# Altium schematic sheet HDMI.SchDoc
size A4; SheetNumber: 11; SheetTotal: 13
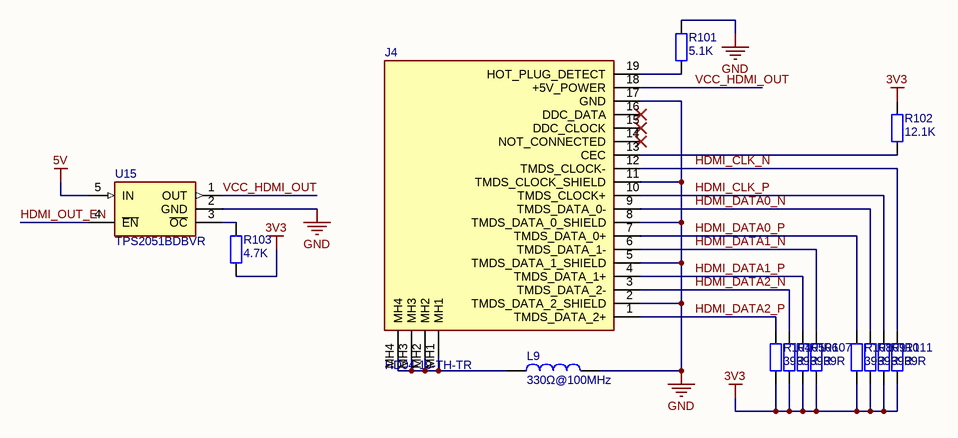
[diagram p0: HDMI.SchDoc]

## Parts
J4  HD04-19-TH-TR  [HD0419THTR]
L9  330Ω@100MHz  [L 0805]
R101  5.1K  [R 0402_L]
R102  12.1K  [R 0805_L]
R103  4.7K  [R 0402_L]
R104  39R  [R 0805_L]
R105  39R  [R 0805_L]
R106  39R  [R 0805_L]
R107  39R  [R 0805_L]
R108  39R  [R 0805_L]
R109  39R  [R 0805_L]
R110  39R  [R 0805_L]
R111  39R  [R 0805_L]
U15  TPS2051BDBVR  [SOT23-5N]

## Nets
3V3: R102.1 R103.1 R104.2 R105.2 R106.2 R107.2 R108.2 R109.2 R110.2 R111.2
5V: U15.5(IN)
GND: J4.2(TMDS_DATA_2_SHIELD) J4.5(TMDS_DATA_1_SHIELD) J4.8(TMDS_DATA_0_SHIELD) J4.11(TMDS_CLOCK_SHIELD) J4.17(GND) L9.2 R101.1 U15.2(GND)
HDMI_CLK_N: J4.12(TMDS_CLOCK-) R111.1
HDMI_CLK_P: J4.10(TMDS_CLOCK+) R110.1
HDMI_DATA0_N: J4.9(TMDS_DATA_0-) R109.1
HDMI_DATA0_P: J4.7(TMDS_DATA_0+) R108.1
HDMI_DATA1_N: J4.6(TMDS_DATA_1-) R107.1
HDMI_DATA1_P: J4.4(TMDS_DATA_1+) R106.1
HDMI_DATA2_N: J4.3(TMDS_DATA_2-) R105.1
HDMI_DATA2_P: J4.1(TMDS_DATA_2+) R104.1
HDMI_OUT_EN: U15.4(~{EN})
VCC_HDMI_OUT: J4.18(+5V_POWER) U15.1(OUT)
NetJ4_13: J4.13(CEC) R102.2
NetJ4_19: J4.19(HOT_PLUG_DETECT) R101.2
NetJ4_MH1: J4.MH1 J4.MH2 J4.MH3 J4.MH4 L9.1
NetR103_2: R103.2 U15.3(~{OC})

Not connected (* = marked no-connect by the designer): J4 14(NOT_CONNECTED)* 15(DDC_CLOCK)* 16(DDC_DATA)*

## Library data of the parts
J4 = HD04-19-TH-TR: HDMI接口; Manufacturer_Name: CUI Devices; Datasheet Link: https://www.cuidevices.com/product/resource/digikeypdf/hd04-19-th-tr.pdf; Height: 6.27mm; Manufacturer_Part_Number: HD04-19-TH-TR; Mouser Part Number: 179-HD04-19-TH-TR; Mouser Price/Stock: https://www.mouser.co.uk/ProductDetail/CUI-Devices/HD04-19-TH-TR?qs=A6eO%252BMLsxmSia1%252B4mHEhKQ%3D%3D
L9 = L: 小功率贴片电感; 版权归属: 源创客; BOM名称: 小功率贴片电感; 学习资源: www.ooocke.com
R101-R111 = R: 贴片电阻; 版权归属: 源创客; BOM名称: 贴片电阻; 学习资源: www.ooocke.com
U15 = TPS2051BDBVR: 模拟开关芯片; Manufacturer_Name: Texas Instruments; Datasheet Link: http://www.ti.com/lit/ds/symlink/tps2051b.pdf; Height: 1.45mm; Manufacturer_Part_Number: TPS2051BDBVR; Mouser Part Number: 595-TPS2051BDBVR; Mouser Price/Stock: https://www.mouser.co.uk/ProductDetail/Texas-Instruments/TPS2051BDBVR?qs=7kv20MEVUljVx%2Fqc0C%252Bidw%3D%3D; Arrow Part Number: TPS2051BDBVR; Arrow Price/Stock: https://www.arrow.com/en/products/tps2051bdbvr/texas-instruments?region=nac